# Altium project sirius_wifi_can.PrjPcb
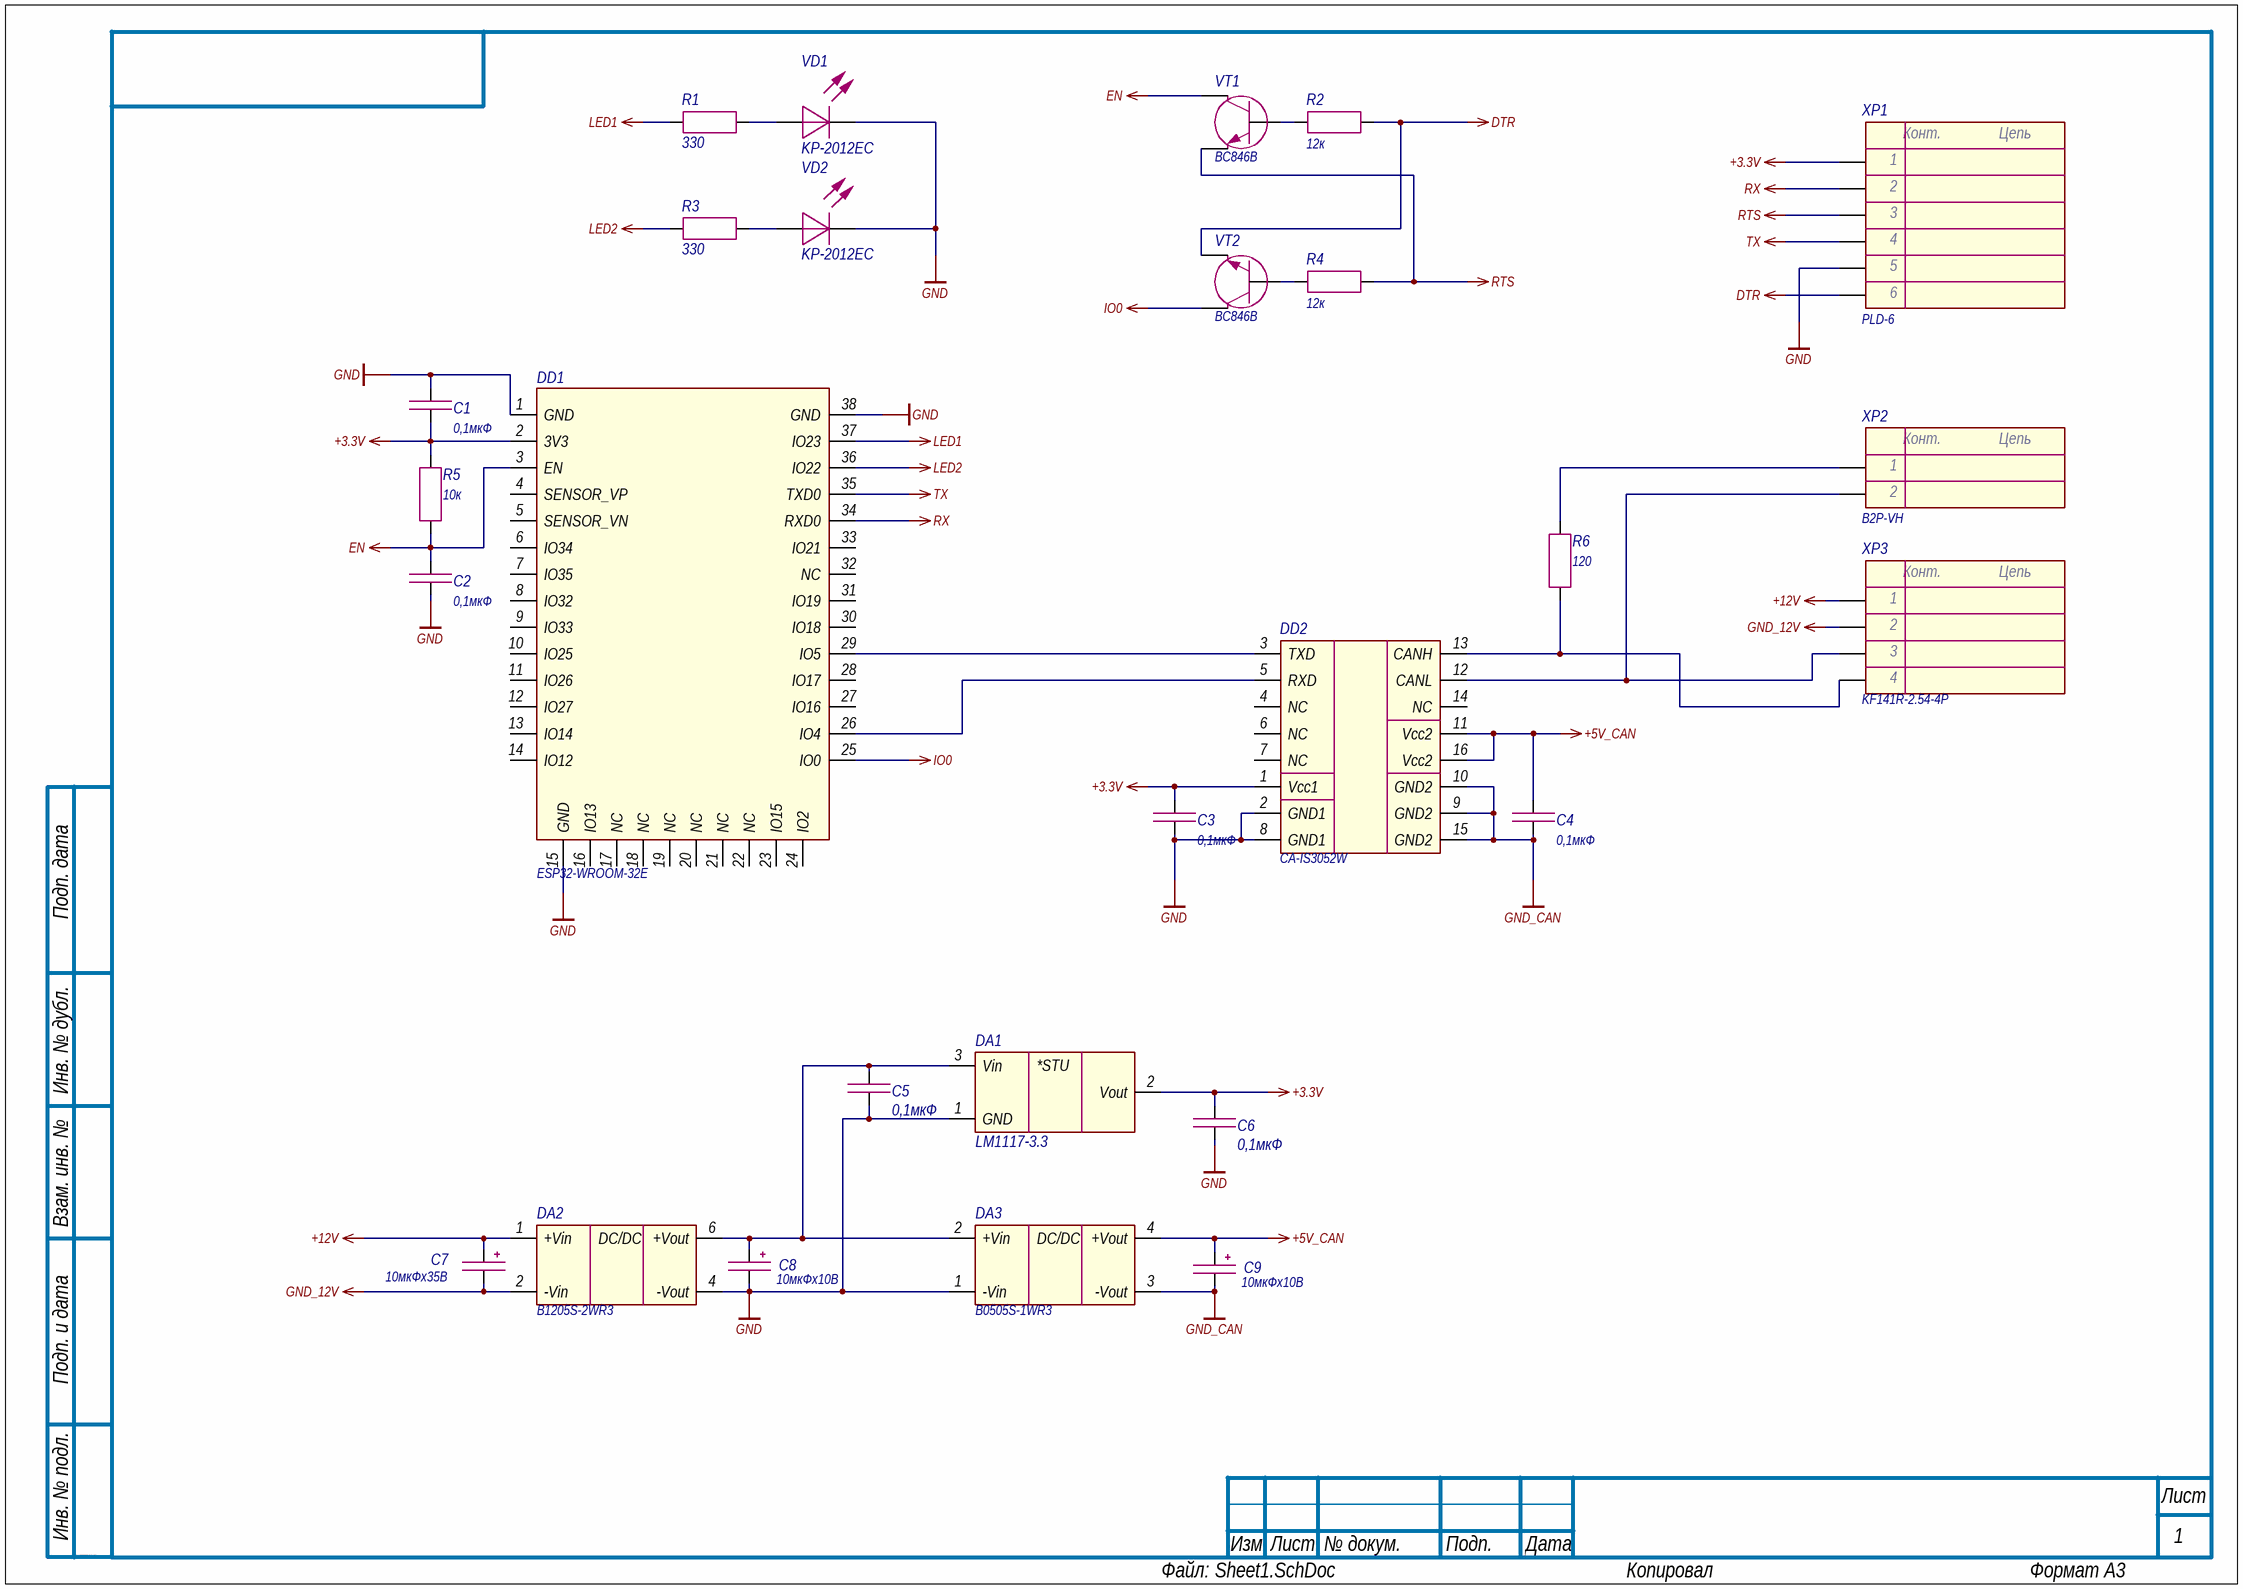
[diagram p0: Sheet1.SchDoc]
1 sheet, 27 parts. Net scope: global (net labels, ports and power ports of the same name join across sheets).
Board file: PCB1.PcbDoc

## Sheet Sheet1.SchDoc
size 420 x 297 mm; SheetNumber: 1; SheetTotal: 1

### Parts
C1  0,1мкФ  [CAP_0603]
C2  0,1мкФ  [CAP_0603]
C3  0,1мкФ  [CAP_0603]
C4  0,1мкФ  [CAP_0603]
C5  0,1мкФ  [CAP_0603]
C6  0,1мкФ  [CAP_0603]
C7  10мкФх35B  [CAP_C]
C8  10мкФх10B  [CAP_A]
C9  10мкФх10B  [CAP_A]
DA1  LM1117-3.3  [TO-252]
DA2  B1205S-2WR3  [B1205S2WR3]
DA3  B0505S-1WR3  [B0505S1WR3]
DD1  ESP32-WROOM-32E  [ESP32_WROOM_32E]
DD2  CA-IS3052W  [SOIC-16W]
R1  330  [RES_0603]
R2  12к  [RES_0603]
R3  330  [RES_0603]
R4  12к  [RES_0603]
R5  10к  [RES_0603]
R6  120  [RES_0805]
VD1  KP-2012EC  [LED_0805]
VD2  KP-2012EC  [LED_0805]
VT1  BC846B  [SOT-23-3]
VT2  BC846B  [SOT-23-3]
XP1  PLD-6  [PLD-6]
XP2  B2P-VH  [HDR-TH_2P-P2.54-V-M]
XP3  KF141R-2.54-4P  [CONN-TH_4P-P2.54_KF141R-2.54-4P]

### Nets
+3.3V: C1.1 C3.2 C6.2 DA1.2(Vout) DD1.2(3V3) DD2.1(Vcc1) R5.2 XP1.1
+5V_CAN: C4.2 C9.1 DA3.4(+Vout) DD2.11(Vcc2) DD2.16(Vcc2)
+12V: C7.1 DA2.1(+Vin) XP3.1
DTR: R2.2 VT2.2(S) XP1.6
EN: C2.2 DD1.3(EN) R5.1 VT1.3(D)
GND: C1.2 C2.1 C3.1 C5.1 C6.1 C8.2 DA1.1(GND) DA2.4(-Vout) DA3.1(-Vin) DD1.1(GND) DD1.15(GND) DD1.38(GND) DD2.2(GND1) DD2.8(GND1) VD1.2(C) VD2.2(C) XP1.5
GND_12V: C7.2 DA2.2(-Vin) XP3.2
GND_CAN: C4.1 C9.2 DA3.3(-Vout) DD2.9(GND2) DD2.10(GND2) DD2.15(GND2)
IO0: DD1.25(IO0) VT2.3(D)
LED1: DD1.37(IO23) R1.1
LED2: DD1.36(IO22) R3.1
RTS: R4.2 VT1.2(S) XP1.3
RX: DD1.34(RXD0) XP1.2
TX: DD1.35(TXD0) XP1.4
NetC5_2: C5.2 C8.1 DA1.3(Vin) DA2.6(+Vout) DA3.2(+Vin)
NetDD1_26: DD1.26(IO4) DD2.5(RXD)
NetDD1_29: DD1.29(IO5) DD2.3(TXD)
NetDD2_12: DD2.12(CANL) XP2.2 XP3.3
NetDD2_13: DD2.13(CANH) R6.1 XP3.4
NetR1_2: R1.2 VD1.1(A)
NetR2_1: R2.1 VT1.1(G)
NetR3_2: R3.2 VD2.1(A)
NetR4_1: R4.1 VT2.1(G)
NetR6_2: R6.2 XP2.1

Not connected (* = marked no-connect by the designer): DD1 4(SENSOR_VP) 5(SENSOR_VN) 6(IO34) 7(IO35) 8(IO32) 9(IO33) 10(IO25) 11(IO26) 12(IO27) 13(IO14) 14(IO12) 16(IO13) 17(NC) 18(NC) 19(NC) 20(NC) 21(NC) 22(NC) 23(IO15) 24(IO2) 27(IO16) 28(IO17) 30(IO18) 31(IO19) 32(NC) 33(IO21); DD2 4(NC) 6(NC) 7(NC) 14(NC)

### Notes on the sheet
- Подп. дата
- Инв. № дубл.
- Взам. инв. №
- Подп. и дата
- Инв. № подл.
- Изм.
- Лист
- № докум.
- Подп.
- Дата
- ALTIUM GOSTBOM2.0 KEV
- Файл:
- Копировал
- Формат А3
- (in symbol B0505S-1WR3) DC/DC
- (in symbol B1205S-2WR3) DC/DC
- (in symbol Connector-2) Конт.; Цепь
- (in symbol Connector-6) Конт.; Цепь
- (in symbol KF141R-2.54-4P) Конт.; Цепь
- (in symbol LM1117-3.3) *STU

### Library data of the parts
C1-C6 = Capacitor: Manufacturer: Murata; Model: GRM188R71H104KA93D; Value: 0,1мкФ; Document: *
C7 = Capacitor_Polar: Model: TECAP, 10 мкФ, 35 В, тип C, 10%; Value: 10мкФх35B; Document: *; Manufacturer: *
C8 C9 = Capacitor_Polar: Model: TECAP, 10 мкФ, 10 В, тип A, 10%; Value: 10мкФх10B; Document: *; Manufacturer: *
DA1 = LM1117-3.3: Manufacturer: STMicroelectronics; Model: LM1117-3.3; Document: *
DA2 = B1205S-2WR3: Power Supply; Manufacturer_Name: Mornsun Power; Datasheet Link: https://www.mornsun-power.com/html/pdf/B1205S-2WR3.html; Height: 10.41mm; Manufacturer_Part_Number: B1205S-2WR3
DA3 = B0505S-1WR3: Power Supply; Manufacturer_Name: Mornsun Power; Datasheet Link: https://datasheet.lcsc.com/szlcsc/1811151639_MORNSUN-Guangzhou-S-T-B0505S-1WR3_C131038.pdf; Height: 10.16mm; Manufacturer_Part_Number: B0505S-1WR3
DD2 = CA-IS3052W: Isolated CAN Transceiver
R1 R3 = Resistor_6: Manufacturer: Yageo; Model: RC0603FR-07330RL; Value: 330; Document: *
R2 R4 = Resistor_14: Manufacturer: Yageo; Model: RC0603FR-0712KL; Value: 12к; Document: *
R5 = Resistor_1: Manufacturer: Yageo; Model: RC0603FR-0710KL; Value: 10к; Document: *
R6 = Resistor_5: Manufacturer: Yageo; Model: RC0805FR-07120RL; Value: 120; Document: *
VD1 VD2 = LED: Manufacturer: Kingbright; Document: *; Model: KP-2012EC
VT1 VT2 = BC846B: npn
XP1 = Connector-6: Manufacturer: Connfly; Model: PLD-6; Document: *
XP2 = Connector-2: Manufacturer: JST; Model: B2P-VH; Document: *